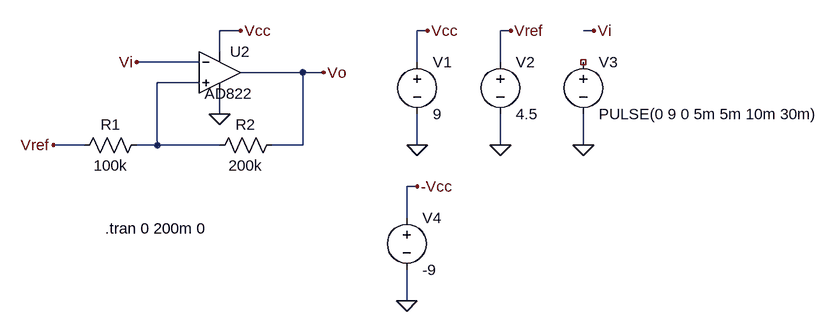
[diagram p0: schematic SchmittTrigger.asc]
SchmittTrigger.asc, the LTspice schematic file:
Version 4
SHEET 1 1296 680
WIRE 336 96 304 96
WIRE 624 96 608 96
WIRE 752 96 736 96
WIRE 880 96 864 96
WIRE 304 128 304 96
WIRE 272 144 176 144
WIRE 608 144 608 96
WIRE 736 144 736 96
WIRE 432 160 336 160
WIRE 464 160 432 160
WIRE 272 176 208 176
WIRE 304 224 304 192
WIRE 96 272 48 272
WIRE 208 272 208 176
WIRE 208 272 176 272
WIRE 304 272 208 272
WIRE 432 272 432 160
WIRE 432 272 384 272
WIRE 608 272 608 224
WIRE 736 272 736 224
WIRE 864 272 864 224
WIRE 608 336 592 336
WIRE 592 384 592 336
WIRE 592 512 592 464
FLAG 608 272 0
FLAG 464 160 Vo
FLAG 864 272 0
FLAG 736 272 0
FLAG 880 96 Vi
FLAG 752 96 Vref
FLAG 624 96 Vcc
FLAG 336 96 Vcc
FLAG 592 512 0
FLAG 608 336 -Vcc
FLAG 176 144 Vi
FLAG 48 272 Vref
FLAG 304 224 0
SYMBOL res 80 288 R270
WINDOW 0 32 56 VTop 2
WINDOW 3 0 56 VBottom 2
SYMATTR InstName R1
SYMATTR Value 100k
SYMBOL res 400 256 R90
WINDOW 0 0 56 VBottom 2
WINDOW 3 32 56 VTop 2
SYMATTR InstName R2
SYMATTR Value 200k
SYMBOL voltage 608 128 R0
SYMATTR InstName V1
SYMATTR Value 9
SYMBOL voltage 864 128 R0
WINDOW 123 0 0 Left 0
WINDOW 39 0 0 Left 0
SYMATTR InstName V3
SYMATTR Value PULSE(0 9 0 5m 5m 10m 30m)
SYMBOL voltage 736 128 R0
WINDOW 123 0 0 Left 0
WINDOW 39 0 0 Left 0
SYMATTR InstName V2
SYMATTR Value 4.5
SYMBOL OpAmps\\AD822 304 96 R0
WINDOW 3 -23 97 Left 2
SYMATTR InstName U2
SYMBOL voltage 592 368 R0
SYMATTR InstName V4
SYMATTR Value -9
TEXT 128 400 Left 2 !.tran 0 200m 0

The netlist it stands for:
* SchmittTrigger.asc
R1 Vref N001 100k
R2 Vo N001 200k
V1 Vcc 0 9
V3 NC_01 0 PULSE(0 9 0 5m 5m 10m 30m)
V2 Vref 0 4.5
XU2 N001 Vi Vcc 0 Vo AD822  ; pins In+ In- V+ V- OUT
V4 -Vcc 0 -9
.tran 0 200m 0
.backanno
.end